# EAGLE design Base-WTV020 (EAGLE 6.4)
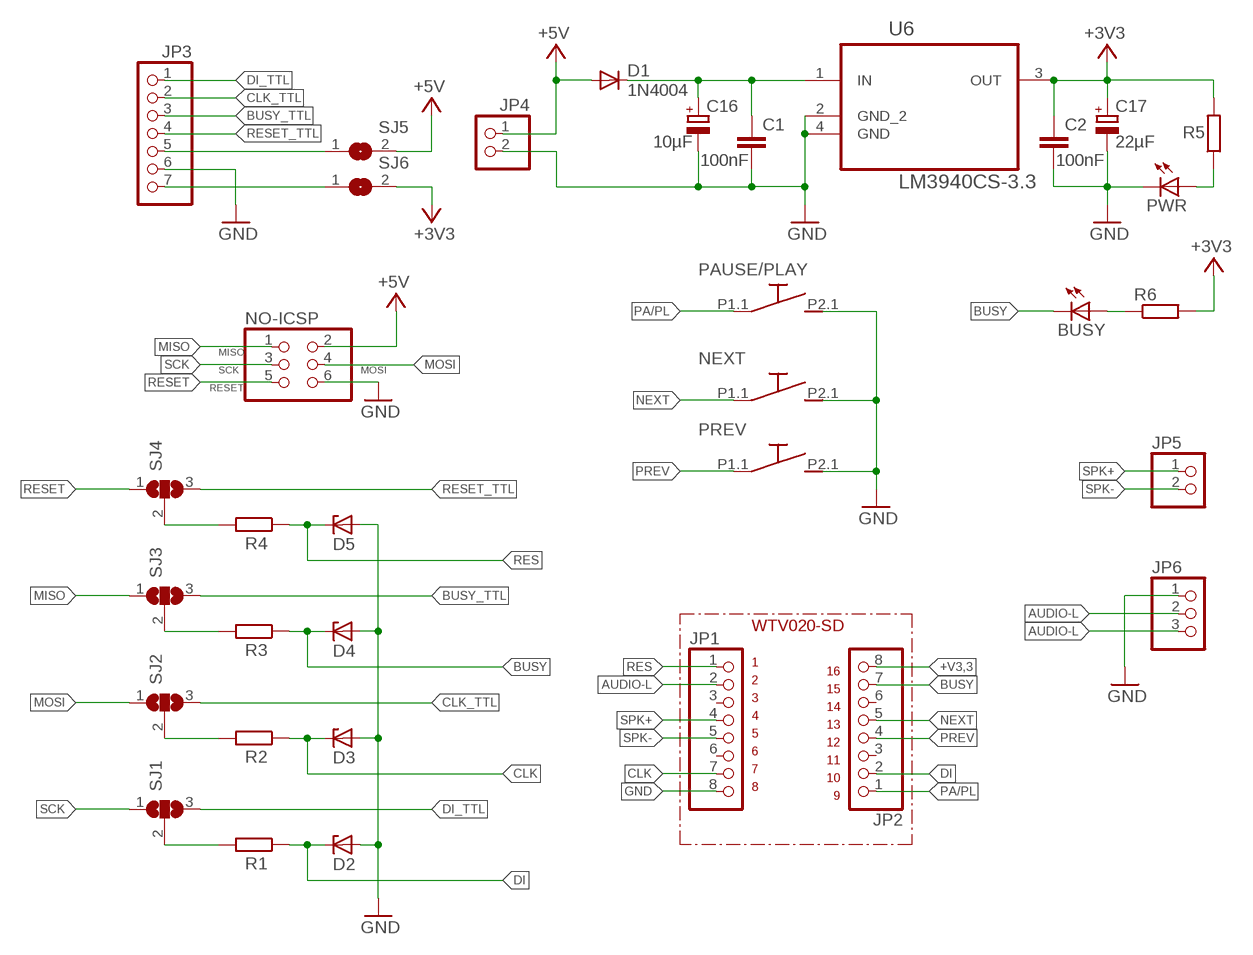
[diagram p0: schematic, sheet 1]

## Parts
BUSY  LED3MM  [LED3MM]
C1  100nF  C-EUC0805  [C0805]
C2  100nF  C-EUC0805  [C0805]
C16  10µF  CPOL-EUE2.5-5  [E2,5-5]
C17  22µF  CPOL-EUE2.5-5  [E2,5-5]
D1  1N4004  [DO41-10]
D2  ZENER-DIODESOD80C  [SOD80C]
D3  ZENER-DIODESOD80C  [SOD80C]
D4  ZENER-DIODESOD80C  [SOD80C]
D5  ZENER-DIODESOD80C  [SOD80C]
JP1  PINHD-1X8  [1X08]
JP2  PINHD-1X8  [1X08]
JP3  PINHD-1X7  [1X07]
JP4  PINHD-1X2  [1X02]
JP5  PINHD-1X2  [1X02]
JP6  PINHD-1X3  [1X03]
NEXT  SMDTASTE  [SMDTASTE]
NO-ICSP  PINHD-2X3  [2X03]
PAUSE/PLAY  SMDTASTE  [SMDTASTE]
PREV  SMDTASTE  [SMDTASTE]
PWR  LED3MM  [LED3MM]
R1  R-EU_M1206  [M1206]
R2  R-EU_M1206  [M1206]
R3  R-EU_M1206  [M1206]
R4  R-EU_M1206  [M1206]
R5  R-EU_M1206  [M1206]
R6  R-EU_M1206  [M1206]
SJ1  SJ2W  [SJ_2]
SJ2  SJ2W  [SJ_2]
SJ3  SJ2W  [SJ_2]
SJ4  SJ2W  [SJ_2]
SJ5  SJ  [SJ]
SJ6  SJ  [SJ]
U6  LM3940CS-3.3  LM2940CS-5.0  [TO254P1435X464-4N]

## Nets
+5V [usbvcc]: D1.A JP4.1 NO-ICSP.2 SJ5.2
+V3,3 [usbvcc]: C2.1 C17.+ JP2.8 R5.2 R6.2 SJ6.2 U6.3(OUT) ; supply symbol labelled +3V3
AUDIO-L: JP1.2 JP6.2 JP6.3
BUSY: BUSY.K(C) D4.C JP2.7 R3.1
BUSY_TTL: JP3.3 SJ3.3
CLK: D3.C JP1.7 R2.1
CLK_TTL: JP3.2 SJ2.3
DI: D2.C JP2.2 R1.1
DI_TTL: JP3.1 SJ1.3
GND [usbvcc]: C1.2 C2.2 C16.- C17.- D2.A D3.A D4.A D5.A JP1.8 JP3.6 JP4.2 JP6.1 NEXT.P2.1 NO-ICSP.6 PAUSE/PLAY.P2.1 PREV.P2.1 PWR.K(C) U6.2(GND_2) U6.4(GND)
MISO: NO-ICSP.1 SJ3.1
MOSI: NO-ICSP.4 SJ2.1
N$1: PWR.A R5.1
N$2: BUSY.A R6.1
N$3: R1.2 SJ1.2
N$4: R2.2 SJ2.2
N$5: R3.2 SJ3.2
N$6: R4.2 SJ4.2
N$9 [usbvcc]: C1.1 C16.+ D1.C U6.1(IN)
N$13: JP3.5 SJ5.1
N$15: JP3.7 SJ6.1
NEXT: JP2.5 NEXT.P1.1
PA/PL: JP2.1 PAUSE/PLAY.P1.1
PREV: JP2.4 PREV.P1.1
RES: D5.C JP1.1 R4.1
RESET: NO-ICSP.5 SJ4.1
RESET_TTL: JP3.4 SJ4.3
SCK: NO-ICSP.3 SJ1.1
SPK+: JP1.4 JP5.1
SPK-: JP1.5 JP5.2
Unconnected: JP1.3 JP1.6 JP2.3 JP2.6

## Notes on the sheet
- WTV020-SD
- 1 | 16
- 2 | 15
- 3 | 14
- 4 | 13
- 5 | 12
- 6 | 11
- 7 | 10
- 8 | 9

## Library data of the parts
BUSY PWR = led:LED: LED OSRAM: - CHIPLED LG R971, LG N971, LY N971, LG Q971, LY Q971, LO R971, LY R971 LH N974, LH R974 LS Q976, LO Q976, LY Q976 LO Q996 - Hyper CHIPLED LW Q18S LB Q993, LB Q99A, LB R99A - SideLED LS A670, LO A670, LY A670, LG A670, LP A670 LB A673, LV A673, LT A673, LW A673 LH A674 LY A675 LS A676, LA A676, LO A676, LY A676, LW A676 LS A679, LY A679, LG A679 - Hyper Micro SIDELED® LS Y876, LA Y876, LO Y876, LY Y876 LT Y87S - SmartLED LW L88C, LW L88S LB L89C, LB L89S, LG L890 LS L89K, LO L89K, LY L89K LS L896, LA L896, LO L896, LY L896 - TOPLED LS T670, LO T670, LY T670, LG T670, LP T670 LSG T670, LSP T670, LSY T670, LOP T670, LYG T670 LG T671, LOG T671, LSG T671 LB T673, LV T673, LT T673, LW T673 LH T674 LS T676, LA T676, LO T676, LY T676, LB T676, LH T676, LSB T676, LW T676 LB T67C, LV T67C, LT T67C, LS T67K, LO T67K, LY T67K, LW E67C LS E67B, LA E67B, LO E67B, LY E67B, LB E67C, LV E67C, LT E67C LW T67C LS T679, LY T679, LG T679 LS T770, LO T770, LY T770, LG T770, LP T770 LB T773, LV T773, LT T773, LW T773 LH T774 LS E675, LA E675, LY E675, LS T675 LS T776, LA T776, LO T776, LY T776, LB T776 LHGB T686 LT T68C, LB T68C - Hyper Mini TOPLED® LB M676 - Mini TOPLED Santana® LG M470 LS M47K, LO M47K, LY M47K Source: http://www.osram.convergy.de LUXEON: - LUMILED® LXK2-PW12-R00, LXK2-PW12-S00, LXK2-PW14-U00, LXK2-PW14-V00 LXK2-PM12-R00, LXK2-PM12-S00, LXK2-PM14-U00 LXK2-PE12-Q00, LXK2-PE12-R00, LXK2-PE12-S00, LXK2-PE14-T00, LXK2-PE14-U00 LXK2-PB12-K00, LXK2-PB12-L00, LXK2-PB12-M00, LXK2-PB14-N00, LXK2-PB14-P00, LXK2-PB14-Q00 LXK2-PR12-L00, LXK2-PR12-M00, LXK2-PR14-Q00, LXK2-PR14-R00 LXK2-PD12-Q00, LXK2-PD12-R00, LXK2-PD12-S00 LXK2-PH12-R00, LXK2-PH12-S00 LXK2-PL12-P00, LXK2-PL12-Q00, LXK2-PL12-R00 Source: www.luxeon.com KINGBRIGHT: KA-3528ASYC Source: www.kingbright.com
C1 C2 = resistor:C-EU: CAPACITOR, European symbol
C16 C17 = resistor:CPOL-EU: POLARIZED CAPACITOR, European symbol
D1 = diode:1N4004: DIODE general purpose rectifier, 1 A
D2-D5 = diode:ZENER-DIODE: Z-Diode
JP1 JP2 = pinhead:PINHD-1X8: PIN HEADER
JP3 = pinhead:PINHD-1X7: PIN HEADER
JP4 JP5 = pinhead:PINHD-1X2: PIN HEADER
JP6 = pinhead:PINHD-1X3: PIN HEADER
NEXT PAUSE/PLAY PREV = SMD-Taster:SMDTASTE
NO-ICSP = SmartPrj:PINHD-2X3: PIN HEADER
R1-R6 = resistor:R-EU_: RESISTOR, European symbol
SJ1-SJ4 = jumper:SJ2W: SMD solder JUMPER
SJ5 SJ6 = jumper:SJ: SMD solder JUMPER
U6 = LM2940CS-5.0:LM2940CS-5.0: Dropout Regulator; MPN: LM2940CS-5.0; OC_FARNELL: 9779850; OC_NEWARK: 07B6352; PACKAGE: TO-263-3; SUPPLIER: NationalSemiconductor

## Net classes
3 usbvcc: width 0.508 mm, drill 0.61 mm, clearance 0.254 mm

## Board
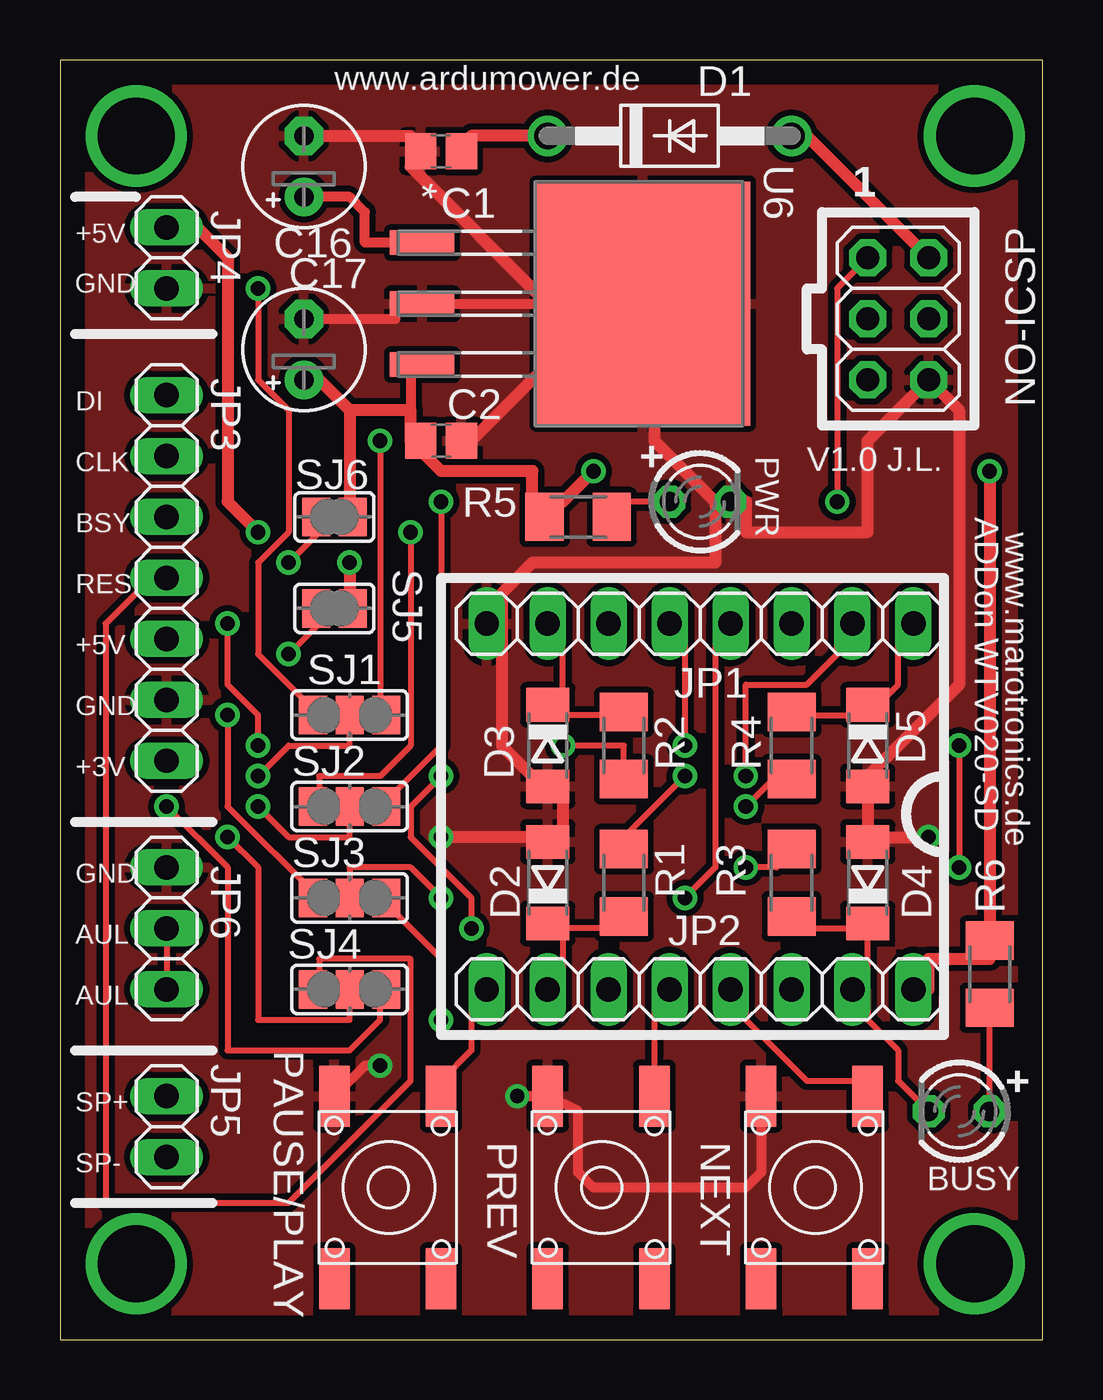
[diagram p1: board, top side]
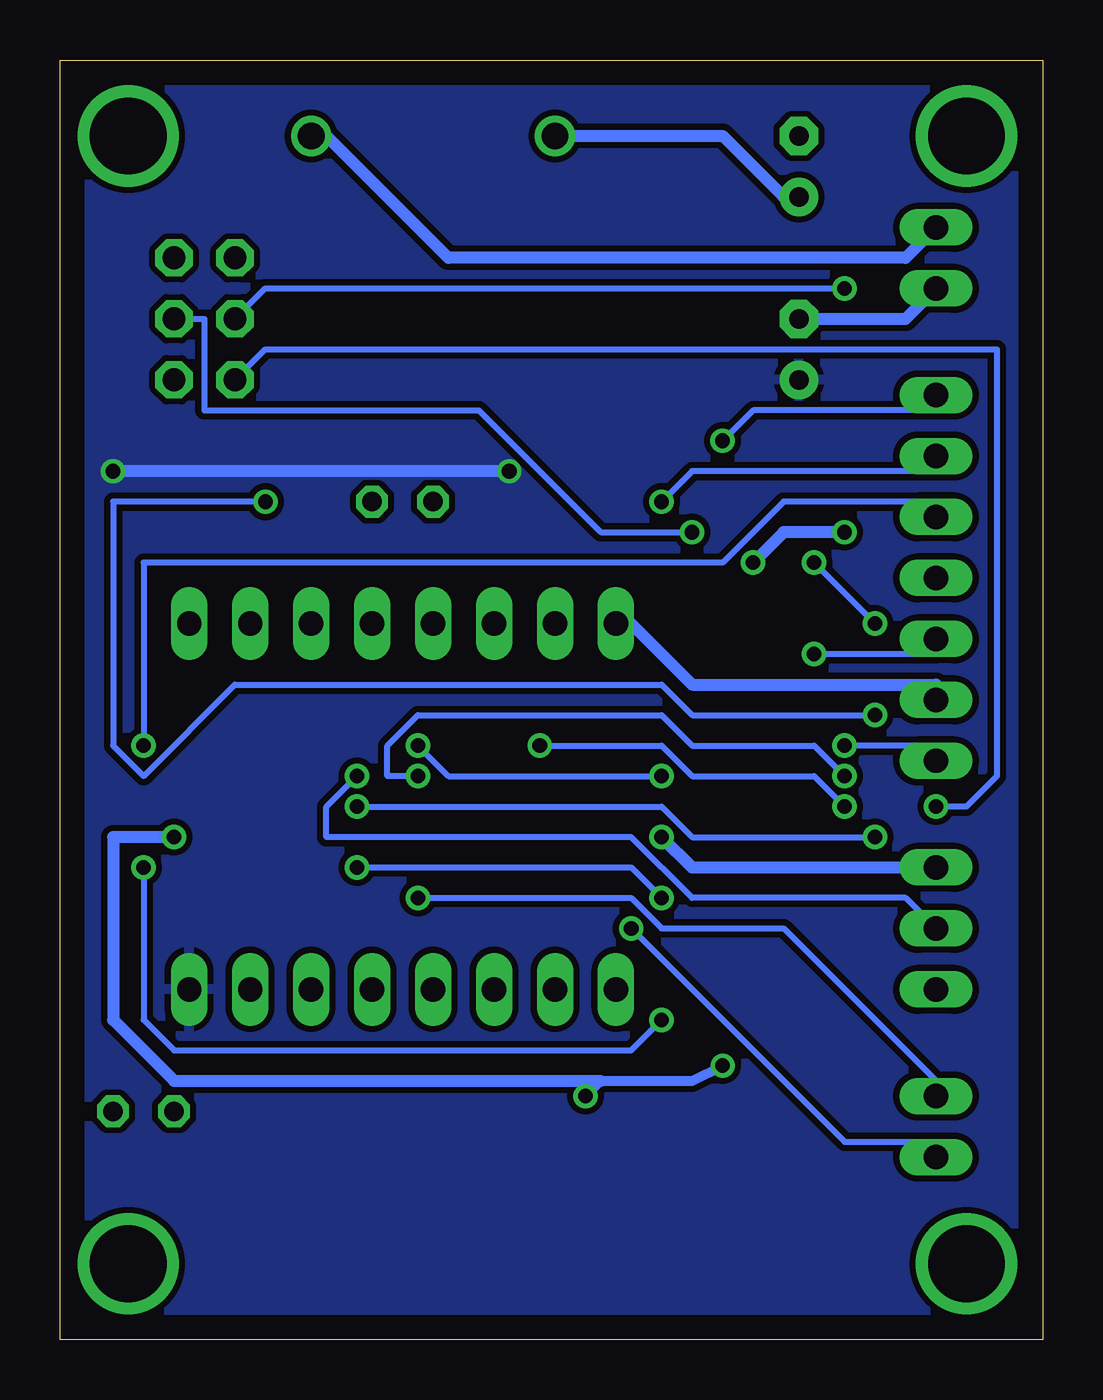
[diagram p2: board, bottom side, seen from below]

Size 40.95 x 53.33 mm. Coordinates in mm from the lower left corner, seen from the top.
Outline: 0,0 40.95,0 40.95,53.33 0,53.33 0,0
Copper layers (1*16): Top 0.035mm / dielectric 1.5mm / Bottom 0.035mm
Design rules "default": minimum track width 10mil, minimum drill 24mil, track to track 8mil, track to pad 8mil, pad to pad 8mil, via to via 8mil, smd to smd 8mil, copper to edge 40mil, drill to drill 8mil, minimum pad ring 10mil, minimum via ring 8mil, stop-mask expansion 4mil, vias tented up to drill 0mil, thermal gap 10mil

### Footprints (pad centres in the part's own frame; a part is rotated, then mirrored left to right if it is on the bottom)
LED3MM = drill 0.813 octagon: A -1.27,0; K 1.27,0
C0805 = smd 1.3 x 1.5: 1 -0.85,0; 2 0.85,0
E2,5-5 = drill 0.813 pad 1.6: + -1.27,0 | drill 0.813 pad 1.6 octagon: - 1.27,0
DO41-10 = drill 1.118: A 5.08,0; C -5.08,0
SOD80C = smd 1.4 x 1.8: A 1.7,0; C -1.7,0
1X08 = drill 1.016 long: 1 -8.89,0; 2 -6.35,0; 3 -3.81,0; 4 -1.27,0; 5 1.27,0; 6 3.81,0; 7 6.35,0; 8 8.89,0
1X07 = drill 1.016 long: 1 -7.62,0; 2 -5.08,0; 3 -2.54,0; 4 0,0; 5 2.54,0; 6 5.08,0; 7 7.62,0
1X02 = drill 1.016 long: 1 -1.27,0; 2 1.27,0
1X03 = drill 1.016 long: 1 -2.54,0; 2 0,0; 3 2.54,0
SMDTASTE = smd 2.54 x 1.27: P1.1 -3.81,2.54; P1.2 3.81,2.54; P2.1 -3.81,-1.905; P2.2 3.81,-1.905
2X03 = drill 0.95 pad 1.55 octagon: 1 -2.54,-1.27; 2 -2.54,1.27; 3 0,-1.27; 4 0,1.27; 5 2.54,-1.27; 6 2.54,1.27
M1206 = smd 1.6 x 2: 1 -1.4,0; 2 1.4,0
SJ_2 = smd 1.168 x 1.6: 1 -1.524,0; 2 0,0; 3 1.524,0
SJ = smd 1.168 x 1.6: 1 -0.762,0; 2 0.762,0
TO254P1435X464-4N = smd 1.016 x 2.692: 1 -2.54,-9.042; 2 0,-9.042; 3 2.54,-9.042 | smd 10.16 x 8.941: 4 0,0.152

### Placement (x,y rotation side)
BUSY  37.47,9.53 180 top
C1  15.88,49.53 180 top
C2  15.88,37.47 0 top
C16  10.16,48.9 90 top
C17  10.16,41.27 90 top
D1  25.4,50.16 0 top
D2  20.32,19.05 90 top
D3  20.32,24.76 270 top
D4  33.66,19.05 90 top
D5  33.66,24.76 270 top
JP1  26.67,29.84 180 top
JP2  26.67,14.61 0 top
JP3  4.44,31.75 270 top
JP4  4.44,45.09 270 top
JP5  4.44,8.89 270 top
JP6  4.44,17.14 270 top
NEXT  31.12,6.35 270 top
NO-ICSP  34.92,42.55 270 top
PAUSE/PLAY  13.34,6.35 270 top
PREV  22.23,6.35 270 top
PWR  26.67,34.93 0 top
R1  23.5,19.05 90 top
R2  23.5,24.76 270 top
R3  30.48,19.05 90 top
R4  30.48,24.76 270 top
R5  21.59,34.29 180 top
R6  38.73,15.24 90 top
SJ1  12.07,26.04 0 top
SJ2  12.07,22.22 0 top
SJ3  12.07,18.41 0 top
SJ4  12.07,14.61 180 top
SJ5  11.43,30.48 0 top
SJ6  11.43,34.29 0 top
U6  24.13,43.18 270 top

### Tracks (layer width: path | path; a pad name or v marks a point on that pad's centre or on a via)
+5V  (via drill 0.61)
  Top 0.508: NO-ICSP.2 31.12,50.16 D1.A | v12.07,32.39 12.07,31.11 SJ5.2 | v8.25,33.66 6.99,34.93 6.99,45.09 5.71,46.36 JP4.1
  Bottom 0.508: v12.07,32.39 10.8,33.66 v8.25,33.66 | JP4.1 5.71,45.09 24.77,45.09 29.84,50.16 D1.A
+V3,3  (via drill 0.61)
  Top 0.406: U6.3 14.61,40.16 14.61,38.73
  Top 0.508: 12.07,38.73 12.07,34.93 SJ6.2 | 12.07,38.73 10.8,40.01 C17.+ | JP2.8 36.2,14.61 36.2,15.88 38.73,15.88 R6.2 v38.73,36.2 | 14.61,37.47 15.88,36.2 19.69,36.2 19.69,34.93 R5.2 20.96,34.93 v22.23,36.2 | 12.07,38.73 14.61,38.73 14.61,37.47 | 14.61,37.47 C2.1
  Bottom 0.508: v22.23,36.2 v38.73,36.2
  pour Bottom: 0.63,0.64 0.63,52.71 40.64,52.71 40.64,0.64
AUDIO-L  (via drill 0.61)
  Top 0.254: JP6.2 JP6.3 | v28.58,23.49 28.58,27.3 31.12,27.3 32.38,28.57 32.38,29.84 JP1.2
  Bottom 0.254: v28.58,23.49 29.84,22.22 29.84,20.95 17.14,20.95 14.61,18.41 5.71,18.41 JP6.2
BUSY
  Top 0.254: 33.66,17.14 31.12,17.14 R3.1 | BUSY.K 34.92,10.79 34.92,12.06 33.66,13.34 33.66,14.61 | 33.66,14.61 33.66,17.14 | 33.66,17.14 D4.C | 33.66,14.61 JP2.7
BUSY_TTL  (via drill 0.61)
  Top 0.254: v15.88,13.34 15.88,15.88 13.34,18.41 SJ3.3 | v37.47,24.76 v37.47,19.68
  Bottom 0.254: v15.88,13.34 17.14,12.06 36.2,12.06 37.47,13.34 v37.47,19.68 | v37.47,24.76 37.47,32.39 13.34,32.39 10.8,34.93 4.44,34.93 JP3.3
CLK
  Top 0.254: 20.96,26.04 23.5,26.04 R2.1 | 20.96,26.04 20.96,29.84 JP1.7 | 20.96,26.04 D3.C
CLK_TTL  (via drill 0.61)
  Top 0.254: v15.88,34.93 15.88,24.76 13.34,22.22 SJ2.3
  Bottom 0.254: v15.88,34.93 14.61,36.2 4.44,36.2 JP3.2
DI
  Top 0.254: 20.96,17.14 23.5,17.14 R1.1 | 20.96,17.14 20.96,14.61 JP2.2 | 20.96,17.14 D2.C
DI_TTL  (via drill 0.61)
  Top 0.254: v13.34,37.47 13.34,26.04 SJ1.3
  Bottom 0.254: v13.34,37.47 12.07,38.73 4.44,38.73 JP3.1
GND  (via drill 0.6, 0.61)
  Top 0.406: 10.8,42.55 13.97,42.55 13.97,43.18 U6.2 20.32,43.18 | NEXT.P2.1 29.21,6.99 28.58,6.35 22.23,6.35 21.59,6.99 21.59,9.53 PREV.P2.1 v19.05,10.16 | v13.34,11.43 12.7,11.43 PAUSE/PLAY.P2.1
  Top 0.508: 18.41,29.84 18.41,24.76 19.69,23.49 D3.A 20.96,23.49 20.96,20.95 D2.A 19.69,20.95 v15.88,20.95 | 33.66,20.95 D5.A 33.66,23.49 37.47,27.3 37.47,38.73 NO-ICSP.6 33.66,37.47 33.66,33.66 28.58,33.66 28.58,34.93 PWR.K 27.3,34.93 | C16.- 14.61,50.16 C1.2 14.61,48.9 20.32,43.18 20.96,42.55 20.96,41.27 | 10.8,42.55 C17.- | 20.96,41.27 23.5,43.82 U6.4 | 20.96,41.27 17.14,37.47 C2.2 | 27.3,34.93 24.77,37.47 24.77,42.55 U6.4 | 20.96,41.27 U6.4 | 18.41,29.84 18.41,31.11 19.69,32.39 27.3,32.39 27.3,34.93 | 18.41,29.84 JP1.8 | 33.66,20.95 v36.2,20.95 | 33.66,20.95 D4.A
  Bottom 0.406: v19.05,10.16 18.41,10.79 14.61,10.79 v13.34,11.43
  Bottom 0.508: JP6.1 14.61,19.68 v15.88,20.95 | JP3.6 4.44,27.3 14.61,27.3 17.14,29.84 JP1.8 | JP4.2 5.71,42.55 C17.- | 18.41,10.79 36.2,10.79 38.73,13.34 38.73,20.95 v36.2,20.95
  pour Top: 0.63,0.64 0.63,52.71 40.64,52.71 40.64,0.64
MISO  (via drill 0.61)
  Top 0.254: v6.99,26.04 6.99,22.22 10.8,18.41 SJ3.1 | v32.38,34.93 32.38,43.82 NO-ICSP.1
  Bottom 0.254: v6.99,26.04 14.61,26.04 15.88,27.3 33.66,27.3 37.47,23.49 38.73,24.76 38.73,34.93 v32.38,34.93
MOSI  (via drill 0.61)
  Top 0.254: v14.61,33.66 14.61,24.76 13.34,23.49 10.8,23.49 10.8,22.22 SJ2.1
  Bottom 0.254: v14.61,33.66 18.41,33.66 23.5,38.73 34.92,38.73 34.92,42.55 NO-ICSP.4
N$1
  Top 0.254: PWR.A 23.5,34.93 R5.1
N$2
  Top 0.254: BUSY.A R6.1
N$3  (via drill 0.61)
  Top 0.254: SJ1.2 12.07,24.76 9.53,24.76 v8.25,23.49 | v26.04,23.49 23.5,20.95 R1.2
  Bottom 0.254: v8.25,23.49 9.53,24.76 14.61,24.76 15.88,26.04 26.04,26.04 27.3,24.76 27.3,23.49 v26.04,23.49
N$4  (via drill 0.61)
  Top 0.254: SJ2.2 12.07,20.95 9.53,20.95 v8.25,22.22 | v20.96,24.76 23.5,24.76 R2.2
  Bottom 0.254: v8.25,22.22 9.53,23.49 14.61,23.49 15.88,24.76 v20.96,24.76
N$5  (via drill 0.61)
  Top 0.254: SJ3.2 12.07,19.68 14.61,19.68 v15.88,18.41 | v28.58,19.68 29.84,19.68 R3.2
  Bottom 0.254: v15.88,18.41 17.14,19.68 v28.58,19.68
N$6  (via drill 0.61)
  Top 0.254: SJ4.2 12.07,13.34 8.25,13.34 8.25,19.68 v6.99,20.95 | v28.58,22.22 29.84,23.49 R4.2
  Bottom 0.254: v6.99,20.95 14.61,20.95 15.88,22.22 v28.58,22.22
N$7  (via drill 3.2)
  other vias: 38.1,50.16
N$8  (via drill 3.2)
  other vias: 3.17,50.16
N$9
  Top 0.406: U6.1 12.7,45.72 12.7,46.99 12.07,47.62 C16.+
  Top 0.508: D1.C 17.14,50.16 C1.1
  Bottom 0.508: D1.C 13.34,50.16 10.8,47.62 C16.+
N$10  (via drill 3.2)
  other vias: 3.17,3.17
N$11  (via drill 3.2)
  other vias: 38.1,3.17
N$13  (via drill 0.61)
  Top 0.254: v9.53,28.57 10.8,29.84 SJ5.1
  Bottom 0.254: v9.53,28.57 4.44,28.57 JP3.5
N$15  (via drill 0.61)
  Top 0.254: v9.53,32.39 10.8,33.66 SJ6.1 | v6.99,29.84 6.99,27.3 8.25,26.04 v8.25,24.76
  Bottom 0.254: v6.99,29.84 v9.53,32.39 | v8.25,24.76 4.44,24.76 JP3.7
NEXT
  Top 0.254: NEXT.P1.1 33.66,10.79 31.12,10.79 28.58,13.34 28.58,14.61 JP2.5
PA/PL
  Top 0.254: PAUSE/PLAY.P1.1 15.88,10.79 17.14,12.06 17.14,14.61 JP2.1
PREV
  Top 0.254: PREV.P1.1 24.77,14.61 JP2.4
RES
  Top 0.254: 33.66,26.04 31.12,26.04 R4.1 | 33.66,26.04 34.92,27.3 34.92,29.84 JP1.1 | 33.66,26.04 D5.C
RESET  (via drill 0.61)
  Top 0.254: v4.44,22.22 6.99,19.68 6.99,12.06 12.07,12.06 13.34,13.34 13.34,14.61 SJ4.1
  Bottom 0.254: v4.44,22.22 3.17,22.22 1.91,23.49 1.91,41.27 32.38,41.27 NO-ICSP.5
RESET_TTL
  Top 0.254: SJ4.3 10.8,14.61 10.8,15.88 14.61,15.88 14.61,10.79 9.53,5.71 1.91,5.71 1.91,29.84 4.44,32.39 JP3.4
SCK  (via drill 0.61)
  Top 0.254: v8.25,43.82 8.25,40.01 9.53,38.73 9.53,33.66 8.25,32.39 8.25,28.57 10.8,26.04 SJ1.1
  Bottom 0.254: v8.25,43.82 32.38,43.82 NO-ICSP.3
SPK+  (via drill 0.61)
  Top 0.254: v26.04,18.41 27.3,19.68 27.3,29.84 JP1.4
  Bottom 0.254: v26.04,18.41 17.14,18.41 15.88,17.14 10.8,17.14 4.44,10.79 JP5.1
SPK-  (via drill 0.61)
  Top 0.254: v17.14,17.14 17.14,18.41 14.61,20.95 14.61,22.22 v15.88,23.49 | v26.04,24.76 26.04,29.84 JP1.5
  Bottom 0.254: v17.14,17.14 8.25,8.26 4.44,8.26 JP5.2 | v15.88,23.49 24.77,23.49 v26.04,24.76

### Text on the board
tPlace: www.ardumower.de | 1 | +5V | GND | DI | CLK | + | V1.0 J.L. | ADDon WTV020-SD | BSY | www.marotronics.de | RES | +5V | GND | +3V | GND | AUL | AUL | + | SP+ | SP-